# Altium project MSXIV_SolarSense.PrjPcb (part 3 of 3)

## Sheet I2C_Interface.SchDoc
size Letter; Organization: Midnight Sun Solar Rayce Car Team; Address1: University of Waterloo; Address2: 200 University Ave W; Address3: Waterloo, ON, Canada; Address4: N2L 3E9; Website: www.uwmidsun.com
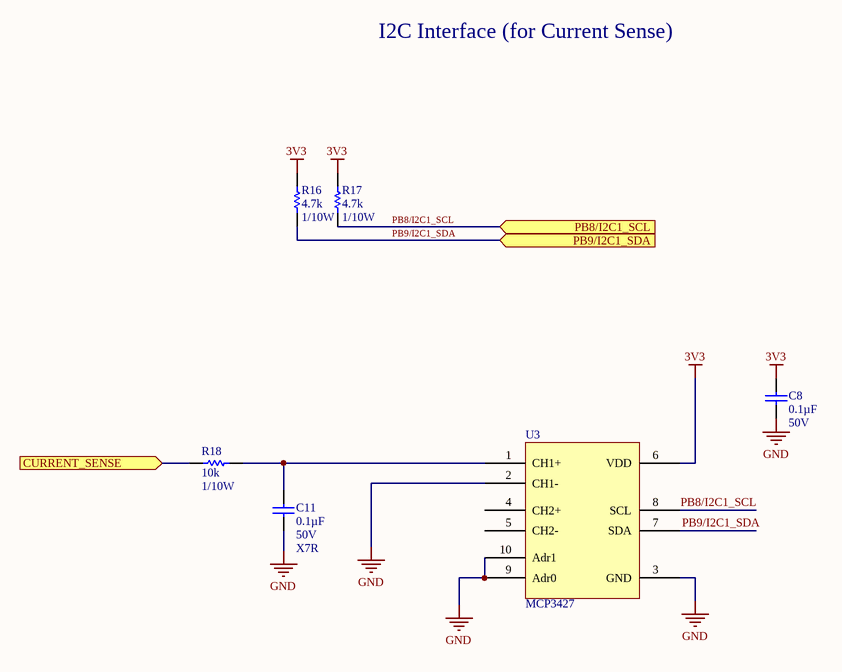
[diagram p6: I2C_Interface.SchDoc]

### Parts
C8  Capacitance: 0.1µF  Voltage: 50V  [CAP, 0603]  (hidden comment: CAP CER 0.1UF 50V 10% X7R 0603)
C11  Capacitance: 0.1µF  Voltage: 50V  Temperature Coefficient: X7R  [CAP, 0603]  (hidden comment: CAP CER 0.1UF 50V 10% X7R 0603)
R16  Resistance (Ohms): 4.7k  Power (Watts): 1/10W  [RES, 0603]  (hidden comment: RES 4.7K OHM 1% 1/10W 0603)
R17  Resistance (Ohms): 4.7k  Power (Watts): 1/10W  [RES, 0603]  (hidden comment: RES 4.7K OHM 1% 1/10W 0603)
R18  Resistance: 10k  Power: 1/10W  [RES, 0603]  (hidden comment: RES 10K OHM 1% 1/10W 0603)
U3  Base Part Number: MCP3427  [IC ADC MCP3427]  (hidden comment: IC ADC MCP3427 10MSOP)

### Ports
CURRENT_SENSE (in), PB8/I2C1_SCL (in), PB9/I2C1_SDA (in)

### Nets
3V3: C8.1 R16.1 R17.1 U3.6(VDD)
GND: C8.2 C11.2 U3.2(CH1-) U3.3(GND) U3.9(Adr0) U3.10(Adr1)
PB8/I2C1_SCL: R17.2 U3.8(SCL) ; port PB8/I2C1_SCL
PB9/I2C1_SDA: R16.2 U3.7(SDA) ; port PB9/I2C1_SDA
NetC11_1: C11.1 R18.2 U3.1(CH1+)
NetR18_1: R18.1 ; port CURRENT_SENSE

Not connected (* = marked no-connect by the designer): U3 4(CH2+) 5(CH2-)

### Notes on the sheet
- I2C Interface (for Current Sense)
- Project:
- Title:
- Size:
- Project Author
- Letter
- Revision:
- University of Waterloo
- 200 University Ave W
- Waterloo, ON, Canada
- N2L 3E9
- Date:
- Sheet
- of
- Website:

### Library data of the parts
C8 C11 = CAP CER 0.1UF 50V 10% X7R 0603: 0.10µF ±10% 50V Ceramic Capacitor X7R 0603 (1608 Metric); Manufacturer 1: AVX Corporation; Manufacturer Part Number 1: 06035C104KAT2A; Supplier 1: Digi-Key; Supplier Part Number 1: 478-5052-1-ND; Packaging: Cut Tape (CT); Part Status: Active; Operating Temperature: -55°C ~ 125°C; Ratings: -; Mounting Type: Surface Mount, MLCC; Package / Case: 0603 (1608 Metric); Size / Dimension: 0.063" L x 0.032" W (1.60mm x 0.81mm); Height - Seated (Max): -; Thickness (Max): 0.035" (0.90mm); Lead Spacing: -; Lead Style: -; ComponentLink1URL: http://datasheets.avx.com/X7RDielectric.pdf; ComponentLink1Description: http://datasheets.avx.com/X7RDielectric.pdf; Tolerance: ±10%
  C8: Temperature Coefficient: X7R
R16 R17 = RES 4.7K OHM 1% 1/10W 0603: 4.7k Ohm ±1% 0.1W, 1/10W Chip Resistor 0603 (1608 Metric) Moisture Resistant Thick Film; Manufacturer 1: Yageo; Manufacturer Part Number 1: RC0603FR-074K7L; Description 1: RES SMD 4.7K OHM 1% 1/10W 0603; Temperature Coefficient: ±100ppm/°C; Supplier 1: Digi-Key; Supplier Part Number 1: 311-4.70KHRCT-ND; RoHS: RoHS Compliant; Category: Resistors; Stock 1: 3487566; Pricing 1: 1=0.16, 10=0.022, 100=0.0089, 1000=0.00402, 2500=0.00349 (CAD); Packaging: Cut Tape (CT); Part Status: Active; Composition: Thick Film; Features: Moisture Resistant; Operating Temperature: -55°C ~ 155°C; Package / Case: 0603 (1608 Metric); Supplier Device Package: 0603; Size / Dimension: 0.063" L x 0.031" W (1.60mm x 0.80mm); Height - Seated (Max): 0.022" (0.55mm); Failure Rate: -; ComponentLink1URL: http://www.yageo.com/documents/recent/PYu-RC_Group_51_RoHS_L_7.pdf; ComponentLink1Description: http://www.yageo.com/documents/recent/PYu-RC_Group_51_RoHS_L_7.pdf; Tolerance: ±1%
R18 = RES 10K OHM 1% 1/10W 0603: RES SMD 10K OHM 1% 1/10W 0603; Manufacturer 1: Yageo; Manufacturer Part Number 1: RC0603FR-0710KL; Temperature Coefficient: ±100ppm/°C; Supplier 1: Digi-Key; Supplier Part Number 1: 311-10.0KHRCT-ND; Packaging: Cut Tape (CT); Part Status: Active; Composition: Thick Film; Operating Temperature: -55°C ~ 155°C; Package / Case: 0603 (1608 Metric); Supplier Device Package: 0603; Size / Dimension: 0.063" L x 0.031" W (1.60mm x 0.80mm); Height - Seated (Max): 0.022" (0.55mm); Failure Rate: -; ComponentLink1URL: http://www.yageo.com/documents/recent/PYu-RC_Group_51_RoHS_L_7.pdf; ComponentLink1Description: http://www.yageo.com/documents/recent/PYu-RC_Group_51_RoHS_L_7.pdf; Tolerance: ±1%
U3 = IC ADC MCP3427 10MSOP: 16 Bit Analog to Digital Converter 2 Input 1 Sigma-Delta 10-MSOP; Manufacturer: Microchip Technology; Manufacturer Part Number: MCP3427-E/UN; Number of Bits: 16; Sampling Rate (Per Second): 15; Number of Inputs: 2; Input Type: Differential; Data Interface: I²C; Configuration: MUX-PGA-ADC; Reference Type: Internal; Voltage - Supply, Analog: 2.7 V ~ 5.5 V; Supplier 1: Digi-Key; RoHS: RoHS Compliant; Category: Integrated Circuits (ICs); Stock 1: 3001; Pricing 1: 1=4.32, 25=3.6064, 100=3.2704 (CAD); Packaging: Tube; Part Status: Active; Ratio - S/H:ADC: -; Architecture: Sigma-Delta; Voltage - Supply, Digital: 2.7 V ~ 5.5 V; Features: PGA, Selectable Address; Operating Temperature: -40°C ~ 125°C; Package / Case: 10-TFSOP, 10-MSOP (0.118", 3.00mm Width); Supplier Device Package: 10-MSOP; ComponentLink1URL: http://www.microchip.com/mymicrochip/filehandler.aspx?ddocname=en546216; ComponentLink1Description: http://www.microchip.com/mymicrochip/filehandler.aspx?ddocname=en546216; Supplier Part Number 1: MCP3427-E/UN-ND

## Sheet V_Sns_I2C_Isolators.SchDoc
size B
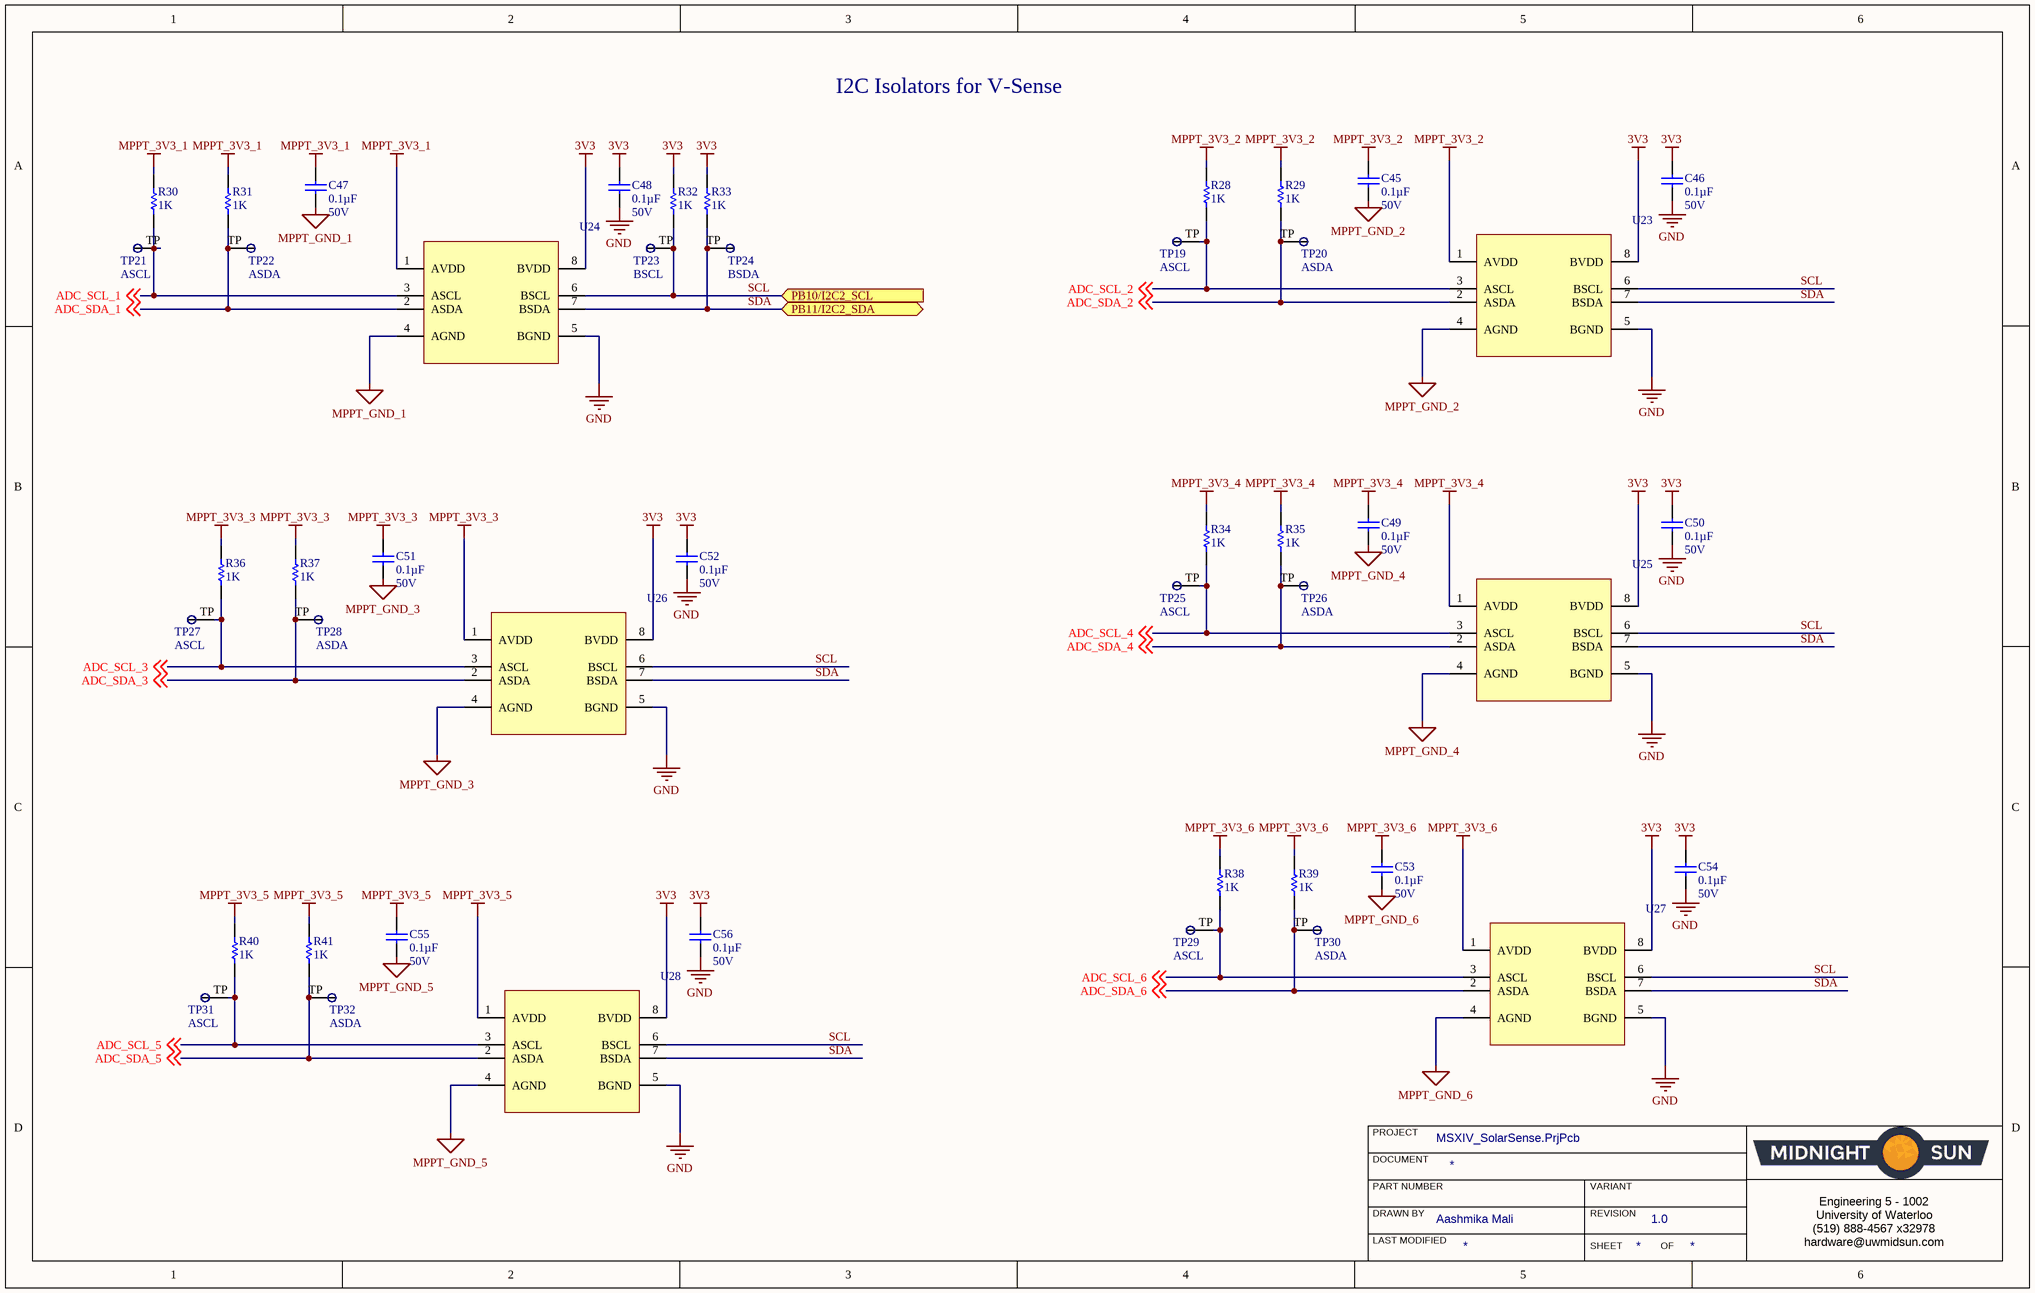
[diagram p7: V_Sns_I2C_Isolators.SchDoc]

### Parts
C45  Capacitance: 0.1µF  Voltage: 50V  [CAP, 0603]  (hidden comment: CAP CER 0.1UF 50V 10% X7R 0603)
C46  Capacitance: 0.1µF  Voltage: 50V  [CAP, 0603]  (hidden comment: CAP CER 0.1UF 50V 10% X7R 0603)
C47  Capacitance: 0.1µF  Voltage: 50V  [CAP, 0603]  (hidden comment: CAP CER 0.1UF 50V 10% X7R 0603)
C48  Capacitance: 0.1µF  Voltage: 50V  [CAP, 0603]  (hidden comment: CAP CER 0.1UF 50V 10% X7R 0603)
C49  Capacitance: 0.1µF  Voltage: 50V  [CAP, 0603]  (hidden comment: CAP CER 0.1UF 50V 10% X7R 0603)
C50  Capacitance: 0.1µF  Voltage: 50V  [CAP, 0603]  (hidden comment: CAP CER 0.1UF 50V 10% X7R 0603)
C51  Capacitance: 0.1µF  Voltage: 50V  [CAP, 0603]  (hidden comment: CAP CER 0.1UF 50V 10% X7R 0603)
C52  Capacitance: 0.1µF  Voltage: 50V  [CAP, 0603]  (hidden comment: CAP CER 0.1UF 50V 10% X7R 0603)
C53  Capacitance: 0.1µF  Voltage: 50V  [CAP, 0603]  (hidden comment: CAP CER 0.1UF 50V 10% X7R 0603)
C54  Capacitance: 0.1µF  Voltage: 50V  [CAP, 0603]  (hidden comment: CAP CER 0.1UF 50V 10% X7R 0603)
C55  Capacitance: 0.1µF  Voltage: 50V  [CAP, 0603]  (hidden comment: CAP CER 0.1UF 50V 10% X7R 0603)
C56  Capacitance: 0.1µF  Voltage: 50V  [CAP, 0603]  (hidden comment: CAP CER 0.1UF 50V 10% X7R 0603)
R28  1K  [RES, 0603]
R29  1K  [RES, 0603]
R30  1K  [RES, 0603]
R31  1K  [RES, 0603]
R32  1K  [RES, 0603]
R33  1K  [RES, 0603]
R34  1K  [RES, 0603]
R35  1K  [RES, 0603]
R36  1K  [RES, 0603]
R37  1K  [RES, 0603]
R38  1K  [RES, 0603]
R39  1K  [RES, 0603]
R40  1K  [RES, 0603]
R41  1K  [RES, 0603]
TP19  ASCL  [Test Point]  (no BOM)
TP20  ASDA  [Test Point]  (no BOM)
TP21  ASCL  [Test Point]  (no BOM)
TP22  ASDA  [Test Point]  (no BOM)
TP23  BSCL  [Test Point]  (no BOM)
TP24  BSDA  [Test Point]  (no BOM)
TP25  ASCL  [Test Point]  (no BOM)
TP26  ASDA  [Test Point]  (no BOM)
TP27  ASCL  [Test Point]  (no BOM)
TP28  ASDA  [Test Point]  (no BOM)
TP29  ASCL  [Test Point]  (no BOM)
TP30  ASDA  [Test Point]  (no BOM)
TP31  ASCL  [Test Point]  (no BOM)
TP32  ASDA  [Test Point]  (no BOM)
U23  IC DGTL ISO 2.5KV 2CH I2C 8SOIC ISO1540DR  [SOIC-8 ISO1540DR]  (value not drawn)
U24  IC DGTL ISO 2.5KV 2CH I2C 8SOIC ISO1540DR  [SOIC-8 ISO1540DR]  (value not drawn)
U25  IC DGTL ISO 2.5KV 2CH I2C 8SOIC ISO1540DR  [SOIC-8 ISO1540DR]  (value not drawn)
U26  IC DGTL ISO 2.5KV 2CH I2C 8SOIC ISO1540DR  [SOIC-8 ISO1540DR]  (value not drawn)
U27  IC DGTL ISO 2.5KV 2CH I2C 8SOIC ISO1540DR  [SOIC-8 ISO1540DR]  (value not drawn)
U28  IC DGTL ISO 2.5KV 2CH I2C 8SOIC ISO1540DR  [SOIC-8 ISO1540DR]  (value not drawn)

### Ports
PB10/I2C2_SCL (in), PB11/I2C2_SDA (bidir)

### Nets
3V3: C46.1 C48.1 C50.1 C52.1 C54.1 C56.1 R32.1 R33.1 U23.8(BVDD) U24.8(BVDD) U25.8(BVDD) U26.8(BVDD) U27.8(BVDD) U28.8(BVDD)
GND: C46.2 C48.2 C50.2 C52.2 C54.2 C56.2 U23.5(BGND) U24.5(BGND) U25.5(BGND) U26.5(BGND) U27.5(BGND) U28.5(BGND)
MPPT_3V3_1: C47.1 R30.1 R31.1 U24.1(AVDD)
MPPT_3V3_2: C45.1 R28.1 R29.1 U23.1(AVDD)
MPPT_3V3_3: C51.1 R36.1 R37.1 U26.1(AVDD)
MPPT_3V3_4: C49.1 R34.1 R35.1 U25.1(AVDD)
MPPT_3V3_5: C55.1 R40.1 R41.1 U28.1(AVDD)
MPPT_3V3_6: C53.1 R38.1 R39.1 U27.1(AVDD)
MPPT_GND_1: C47.2 U24.4(AGND)  [project net HV_HIGH_NEG_BAT_TERM]
MPPT_GND_2: C45.2 U23.4(AGND)
MPPT_GND_3: C51.2 U26.4(AGND)
MPPT_GND_4: C49.2 U25.4(AGND)
MPPT_GND_5: C55.2 U28.4(AGND)
MPPT_GND_6: C53.2 U27.4(AGND)
ADC_SCL_1: R30.2 TP21.TP U24.3(ASCL) ; off-sheet ADC_SCL_1
ADC_SCL_2: R28.2 TP19.TP U23.3(ASCL) ; off-sheet ADC_SCL_2
ADC_SCL_3: R36.2 TP27.TP U26.3(ASCL) ; off-sheet ADC_SCL_3
ADC_SCL_4: R34.2 TP25.TP U25.3(ASCL) ; off-sheet ADC_SCL_4
ADC_SCL_5: R40.2 TP31.TP U28.3(ASCL) ; off-sheet ADC_SCL_5
ADC_SCL_6: R38.2 TP29.TP U27.3(ASCL) ; off-sheet ADC_SCL_6
ADC_SDA_1: R31.2 TP22.TP U24.2(ASDA) ; off-sheet ADC_SDA_1
ADC_SDA_2: R29.2 TP20.TP U23.2(ASDA) ; off-sheet ADC_SDA_2
ADC_SDA_3: R37.2 TP28.TP U26.2(ASDA) ; off-sheet ADC_SDA_3
ADC_SDA_4: R35.2 TP26.TP U25.2(ASDA) ; off-sheet ADC_SDA_4
ADC_SDA_5: R41.2 TP32.TP U28.2(ASDA) ; off-sheet ADC_SDA_5
ADC_SDA_6: R39.2 TP30.TP U27.2(ASDA) ; off-sheet ADC_SDA_6
SCL: R32.2 TP23.TP U23.6(BSCL) U24.6(BSCL) U25.6(BSCL) U26.6(BSCL) U27.6(BSCL) U28.6(BSCL) ; port PB10/I2C2_SCL  [project net PB10/I2C2_SCL]
SDA: R33.2 TP24.TP U23.7(BSDA) U24.7(BSDA) U25.7(BSDA) U26.7(BSDA) U27.7(BSDA) U28.7(BSDA) ; port PB11/I2C2_SDA  [project net PB11/I2C2_SDA]

### Notes on the sheet
- I2C Isolators for V-Sense
- PROJECT
- DOCUMENT
- DRAWN BY
- LAST MODIFIED
- PART NUMBER
- REVISION
- SHEET
- VARIANT
- OF
- Engineering 5 - 1002
  University of Waterloo
  (519) 888-4567 x32978
  hardware@uwmidsun.com

### Library data of the parts
C45-C56 = CAP CER 0.1UF 50V 10% X7R 0603: as C8 on sheet I2C_Interface; Supplier 1: Digi-Key; Supplier Part Number 1: 478-5052-1-ND; Packaging: Cut Tape (CT); Part Status: Active; Operating Temperature: -55°C ~ 125°C; Ratings: -; Mounting Type: Surface Mount, MLCC; Package / Case: 0603 (1608 Metric); Size / Dimension: 0.063" L x 0.032" W (1.60mm x 0.81mm); Height - Seated (Max): -; Thickness (Max): 0.035" (0.90mm); Lead Spacing: -; Lead Style: -; ComponentLink1URL: http://datasheets.avx.com/X7RDielectric.pdf; ComponentLink1Description: http://datasheets.avx.com/X7RDielectric.pdf; Tolerance: ±10%; Temperature Coefficient: X7R
R28-R41 = RES 1K OHM 5% 1/10W 0603: 1k Ohm ±5% 0.1W, 1/10W Chip Resistor 0603 (1608 Metric); Manufacturer: Yageo; Manufacturer Part Number: RC0603JR-071KL; Temperature Coefficient: ±100ppm/°C; Supplier 1: Digi-Key; Supplier Part Number 1: 311-1.0KGRCT-ND; RoHS: RoHS Compliant; Category: Resistors; Stock 1: 4415240; Pricing 1: 1=0.15, 10=0.017, 100=0.0071, 1000=0.0032, 2500=0.00278 (CAD); Packaging: Cut Tape (CT); Part Status: Active; Resistance (Ohms): 1k; Tolerance: ±5%; Power (Watts): 0.1W, 1/10W; Composition: Thick Film; Features: Moisture Resistant; Operating Temperature: -55°C ~ 155°C; Package / Case: 0603 (1608 Metric); Supplier Device Package: 0603; Size / Dimension: 0.063" L x 0.031" W (1.60mm x 0.80mm); Height - Seated (Max): 0.022" (0.55mm); Failure Rate: -; ComponentLink1URL: http://www.yageo.com/documents/recent/PYu-RC_Group_51_RoHS_L_7.pdf; ComponentLink1Description: http://www.yageo.com/documents/recent/PYu-RC_Group_51_RoHS_L_7.pdf
TP19-TP32 = Test Point
U23-U28 = IC DGTL ISO 2.5KV 2CH I2C 8SOIC ISO1540DR: I²C Digital Isolator 2500Vrms 2 Channel 1Mbps 25kV/µs CMTI 8-SOIC (0.154", 3.90mm Width); Manufacturer: Texas Instruments; Number of Channels: 2; Propagation Delay: 70ns; Channel Type: Bidirectional; Isolated Power: No; Pulse Width Distortion (PWD): 21ns; Min Supply Voltage: 3V; Max Supply Voltage: 5.5V; Nominal Supply Current: 3.6mA; Working Voltage: 566V; Supplier 1: Digi-Key; Supplier Part Number 1: 296-34871-1-ND; Stock 1: 10427; Pricing 1: 1=4.80000, 10=4.31400, 25=4.07880, 100=3.35370, 250=3.00924, 500=2.90048, 1000=2.41102 (USD); Case/Package: SOIC; Number of Pins: 8; Min Operating Temperature: -40°C; Max Operating Temperature: 125°C; Package Quantity: 1; Packaging: Tape and Reel; Data Rate: 1Mbps; ComponentLink1URL: https://datasheet.ciiva.com/6579/iso1540-6579723.pdf?src-supplier=Digi-Key; ComponentLink1Description: https://datasheet.ciiva.com/6579/iso1540-6579723.pdf?src-supplier=Digi-Key; Manufacturer Part Number: ISO1540DR; RoHS: Yes; Category: Interface ICs; Mount: Surface Mount; REACH SVHC: No SVHC; Lead Free: Lead Free; ComponentLink2URL: https://datasheet.ciiva.com/6579/iso1540-6579724.pdf?src-supplier=Digi-Key; ComponentLink2Description: https://datasheet.ciiva.com/6579/iso1540-6579724.pdf?src-supplier=Digi-Key; ComponentLink3URL: https://datasheet.ciiva.com/6579/iso1540-6579725.pdf?src-supplier=Digi-Key; ComponentLink3Description: https://datasheet.ciiva.com/6579/iso1540-6579725.pdf?src-supplier=Digi-Key; ComponentLink4URL: https://datasheet.ciiva.com/14196/iso1540-14196749.pdf?src-supplier=Avnet; ComponentLink4Description: https://datasheet.ciiva.com/14196/iso1540-14196749.pdf?src-supplier=Avnet

## Nets that join several sheets
3V3: Controller_Board_Interface (13 pins), SPI_Interface (12 pins), Current_and_Relay_Sense (C7.1 TP6.TP U1.6 U1.8), TemperatureSense (P15.1 P15.5), I2C_Interface (C8.1 R16.1 R17.1 U3.6), V_Sns_I2C_Isolators (14 pins)
12V: Controller_Board_Interface (P1.47 P1.48 P1.49 P1.50), Current_and_Relay_Sense (5 pins)
GND: Controller_Board_Interface (16 pins), SPI_Interface (18 pins), Current_and_Relay_Sense (14 pins), TemperatureSense (12 pins), I2C_Interface (6 pins), V_Sns_I2C_Isolators (12 pins)
HV_HIGH: Voltage_Sense (P4.1 R22.1), Current_and_Relay_Sense (6 pins)
HV_HIGH_NEG_BAT_TERM: Voltage_Sense (5 pins), ADCs (5 pins), SPI_Interface (C29.2 U17.9 U17.10 U17.15), Current_and_Relay_Sense (5 pins), V_Sns_I2C_Isolators (C47.2 U24.4)
MPPT_3V3_1: Voltage_Sense (C57.1 U5.5), ADCs (C24.1 U13.6), SPI_Interface (C29.1 U17.16), V_Sns_I2C_Isolators (C47.1 R30.1 R31.1 U24.1)
MPPT_3V3_2: Voltage_Sense (C15.1 U8.5), ADCs (C22.1 U11.6), SPI_Interface (C31.1 U18.16), V_Sns_I2C_Isolators (C45.1 R28.1 R29.1 U23.1)
MPPT_3V3_3: Voltage_Sense (C19.1 U10.5), ADCs (C23.1 U12.6 U12.10), SPI_Interface (C60.1 U19.16), V_Sns_I2C_Isolators (C51.1 R36.1 R37.1 U26.1)
MPPT_3V3_4: Voltage_Sense (C12.1 U6.5), ADCs (C27.1 U16.6 U16.9), SPI_Interface (C37.1 U20.16), V_Sns_I2C_Isolators (C49.1 R34.1 R35.1 U25.1)
MPPT_3V3_5: Voltage_Sense (C14.1 U7.5), ADCs (C26.1 U15.6 U15.9 U15.10), SPI_Interface (C33.1 U21.16), V_Sns_I2C_Isolators (C55.1 R40.1 R41.1 U28.1)
MPPT_3V3_6: Voltage_Sense (C18.1 U9.5), ADCs (C25.1 U14.6), SPI_Interface (C35.1 U22.16), V_Sns_I2C_Isolators (C53.1 R38.1 R39.1 U27.1)
MPPT_GND_2: Voltage_Sense (7 pins), ADCs (C22.2 U11.2 U11.3 U11.9), SPI_Interface (C31.2 U18.9 U18.10 U18.15), V_Sns_I2C_Isolators (C45.2 U23.4)
MPPT_GND_3: Voltage_Sense (7 pins), ADCs (C23.2 U12.2 U12.3 U12.9), SPI_Interface (C60.2 U19.9 U19.10 U19.15), V_Sns_I2C_Isolators (C51.2 U26.4)
MPPT_GND_4: Voltage_Sense (7 pins), ADCs (C27.2 U16.2 U16.3), SPI_Interface (C37.2 U20.9 U20.10 U20.15), V_Sns_I2C_Isolators (C49.2 U25.4)
MPPT_GND_5: Voltage_Sense (7 pins), ADCs (C26.2 U15.2 U15.3), SPI_Interface (C33.2 U21.9 U21.10 U21.15), V_Sns_I2C_Isolators (C55.2 U28.4)
MPPT_GND_6: Voltage_Sense (7 pins), ADCs (C25.2 U14.2 U14.3 U14.10), SPI_Interface (C35.2 U22.9 U22.10 U22.15), V_Sns_I2C_Isolators (C53.2 U27.4)
ADC_SCL_1: ADCs (U13.8), V_Sns_I2C_Isolators (R30.2 TP21.TP U24.3)
ADC_SCL_2: ADCs (U11.8), V_Sns_I2C_Isolators (R28.2 TP19.TP U23.3)
ADC_SCL_3: ADCs (U12.8), V_Sns_I2C_Isolators (R36.2 TP27.TP U26.3)
ADC_SCL_4: ADCs (U16.8), V_Sns_I2C_Isolators (R34.2 TP25.TP U25.3)
ADC_SCL_5: ADCs (U15.8), V_Sns_I2C_Isolators (R40.2 TP31.TP U28.3)
ADC_SCL_6: ADCs (U14.8), V_Sns_I2C_Isolators (R38.2 TP29.TP U27.3)
ADC_SDA_1: ADCs (U13.7), V_Sns_I2C_Isolators (R31.2 TP22.TP U24.2)
ADC_SDA_2: ADCs (U11.7), V_Sns_I2C_Isolators (R29.2 TP20.TP U23.2)
ADC_SDA_3: ADCs (U12.7), V_Sns_I2C_Isolators (R37.2 TP28.TP U26.2)
ADC_SDA_4: ADCs (U16.7), V_Sns_I2C_Isolators (R35.2 TP26.TP U25.2)
ADC_SDA_5: ADCs (U15.7), V_Sns_I2C_Isolators (R41.2 TP32.TP U28.2)
ADC_SDA_6: ADCs (U14.7), V_Sns_I2C_Isolators (R39.2 TP30.TP U27.2)
NetR18_1: Current_and_Relay_Sense (TP1.TP U1.7), I2C_Interface (R18.1)
PA0_Temp_1: Controller_Board_Interface (P1.25), TemperatureSense (C39.1 P15.6 R43.1)
PA1_Temp_2: Controller_Board_Interface (P1.24), TemperatureSense (C44.1 P15.2 R48.1)
PA2_Temp_3: Controller_Board_Interface (P1.23), TemperatureSense (C40.1 P15.7 R44.1)
PA3_Temp_4: Controller_Board_Interface (P1.22), TemperatureSense (C43.1 P15.3 R47.1)
PA4_Temp_5: Controller_Board_Interface (P1.21), TemperatureSense (C41.1 P15.8 R45.1)
PA5_Temp_6: Controller_Board_Interface (P1.20), TemperatureSense (C42.1 P15.4 R46.1)
PA8/SOLAR_RELAY: Controller_Board_Interface (P1.7), Current_and_Relay_Sense (TP33.TP U4.13)
PB8/I2C1_SCL: Controller_Board_Interface (P1.32), I2C_Interface (R17.2 U3.8)
PB9/I2C1_SDA: Controller_Board_Interface (P1.31), I2C_Interface (R16.2 U3.7)
PB10/I2C2_SCL: Controller_Board_Interface (P1.14), V_Sns_I2C_Isolators (8 pins)
PB11/I2C2_SDA: Controller_Board_Interface (P1.13), V_Sns_I2C_Isolators (8 pins)
PB13_SPI2_SCK: Controller_Board_Interface (P1.10), SPI_Interface (6 pins)
PB14_SPI2_MISO: Controller_Board_Interface (P1.9), SPI_Interface (6 pins)
PB15_SPI2_MOSI: Controller_Board_Interface (P1.8), SPI_Interface (6 pins)
SPI2_CS_1: Controller_Board_Interface (U2.15), SPI_Interface (U17.5)
SPI2_CS_2: Controller_Board_Interface (U2.14), SPI_Interface (U18.5)
SPI2_CS_3: Controller_Board_Interface (U2.13), SPI_Interface (U19.5)
SPI2_CS_4: Controller_Board_Interface (U2.12), SPI_Interface (U20.5)
SPI2_CS_5: Controller_Board_Interface (U2.11), SPI_Interface (U21.5)
SPI2_CS_6: Controller_Board_Interface (U2.10), SPI_Interface (U22.5)
V_SENSE_1: Voltage_Sense (C58.1 R42.2 TP11.TP), ADCs (U13.1)
V_SENSE_2: Voltage_Sense (C17.1 R20.2 TP14.TP), ADCs (U11.1)
V_SENSE_3: Voltage_Sense (C21.1 R26.2 TP18.TP), ADCs (U12.1)
V_SENSE_4: Voltage_Sense (C13.1 R7.2 TP8.TP), ADCs (U16.1)
V_SENSE_5: Voltage_Sense (C16.1 R11.2 TP12.TP), ADCs (U15.1)
V_SENSE_6: Voltage_Sense (C20.1 R24.2 TP16.TP), ADCs (U14.1)